# Altium project Badge.PrjPcb
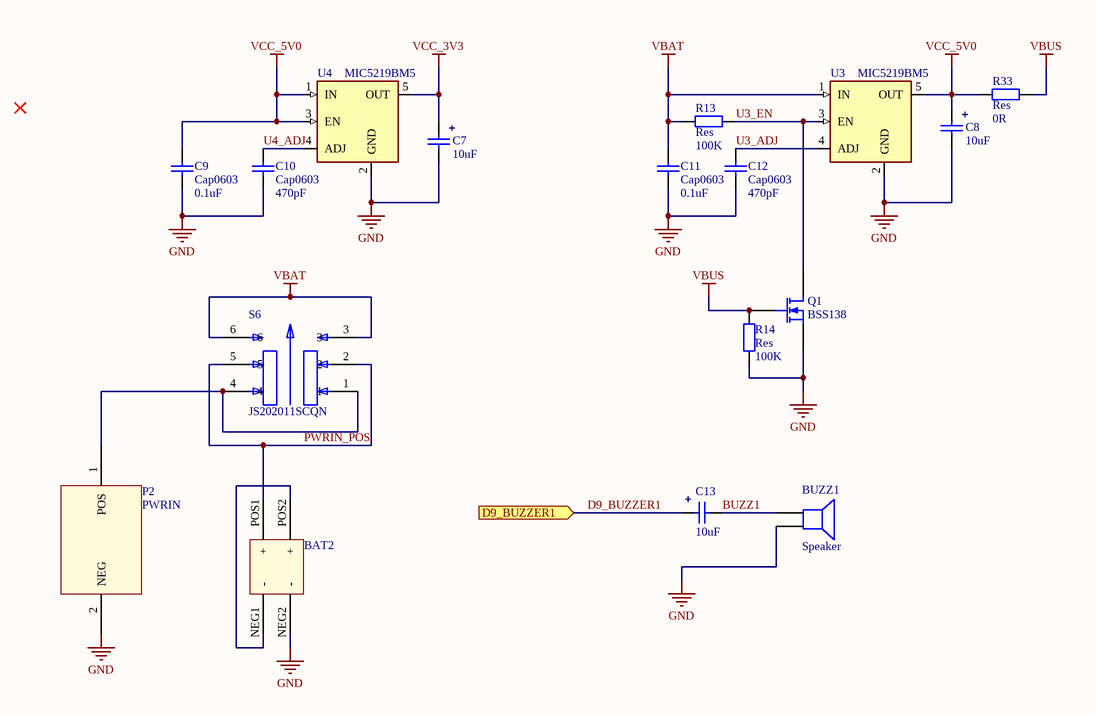
[diagram p0: badge2.SchDoc]
5 sheets, 95 parts. Net scope: flat (ports and power ports of the same name join across sheets).
Board file: badge.PcbDoc
Sheets:
  badge2.SchDoc
  badge3.SchDoc
  badge4.SchDoc
  badge5.SchDoc
  badge.SchDoc

## Sheet badge2.SchDoc
size Letter

### Parts
BAT2  BATT_18650x2  [BATT_18650x2]  (value not drawn)
BUZZ1  Speaker  [SMC]
C7  value 10uF  [C1206 _POL]
C8  value 10uF  [C1206 _POL]
C9  Cap0603  value 0.1uF  [C0603]
C10  Cap0603  value 470pF  [C0603]
C11  Cap0603  value 0.1uF  [C0603]
C12  Cap0603  value 470pF  [C0603]
C13  value 10uF  [C1206 _POL]
P2  PWRIN  [PWRIN]
Q1  BSS138  [SOT23_N]
R13  Res  value 100K  [R0603]
R14  Res  value 100K  [R0603]
R33  Res  value 0R  [R0603]
S6  JS202011SCQN  [SW_JS202011SCQN]
U3  MIC5219BM5  [SOT23-5_N]
U4  MIC5219BM5  [SOT23-5_N]

### Ports
D9_BUZZER1 (in)

### Nets
GND: BAT2.NEG2(-) BUZZ1.2 C7.2 C8.2 C9.1 C10.1 C11.1 C12.1 P2.2(NEG) Q1.2(S) R14.1 U3.2(GND) U4.2(GND)
VBAT: C11.2 R13.1 S6.3 S6.6 U3.1(IN)
VBUS: Q1.3(G) R14.2 R33.2
VCC_3V3: C7.1 U4.5(OUT)
VCC_5V0: C8.1 C9.2 R33.1 U3.5(OUT) U4.1(IN) U4.3(EN)
BUZZ1: BUZZ1.1 C13.2
D9_BUZZER1: C13.1 ; port D9_BUZZER1
PWRIN_POS: BAT2.POS1(+) S6.2 S6.5
U3_ADJ: C12.2 U3.4(ADJ)
U3_EN: Q1.1(D) R13.2 U3.3(EN)
U4_ADJ: C10.2 U4.4(ADJ)
NetBAT2_NEG1: BAT2.NEG1(-) BAT2.POS2(+)
NetP2_1: P2.1(POS) S6.1 S6.4

### Notes on the sheet
- (in symbol CapPol) +

### Library data of the parts
BAT2 = BATT_18650x2: MF: DNP; MP: DNP
BUZZ1 = Speaker: Loudspeaker; MF: DNP; Published: 24-Mar-1999; LatestRevisionDate: 17-Jul-2002; LatestRevisionNote: Re-released for DXP Platform.; PackageReference: PIN2; Publisher: Altium Limited; MP: DNP
C7 C8 C13 = CapPol: Capacitor; MF: KEMET; MP: T491A106K010AT; Published: 8-Jun-2000; LatestRevisionDate: 17-Jul-2002; LatestRevisionNote: Re-released for DXP Platform.; PackageReference: CAP_POL; Publisher: Altium Limited; PackageDescription: SMD Capacitor
C9 = Cap0603: Capacitor; MF: KEMET; MP: C0603C104Z3VACTU; Published: 8-Jun-2000; LatestRevisionDate: 17-Jul-2002; LatestRevisionNote: Re-released for DXP Platform.; PackageReference: 0603; Publisher: Altium Limited; PackageDescription: SMD Capacitor
C10 C12 = Cap0603: Capacitor; MF: KEMET; MP: C0603C471J1GACTU; Published: 8-Jun-2000; LatestRevisionDate: 17-Jul-2002; LatestRevisionNote: Re-released for DXP Platform.; PackageReference: 0603; Publisher: Altium Limited; PackageDescription: SMD Capacitor
C11 = Cap0603: Capacitor; MF: KEMET; MP: C0603C104M4RACTU; Published: 8-Jun-2000; LatestRevisionDate: 17-Jul-2002; LatestRevisionNote: Re-released for DXP Platform.; PackageReference: 0603; Publisher: Altium Limited; PackageDescription: SMD Capacitor
P2 = PWRIN: MF: Molex; MP: S2B-PH-SM4-TB(LF)(SN)
Q1 = MOSFET-N: N-Channel MOSFET; MF: ON Semiconductor; MP: ATSAMD11C14A-SSNTDKR-ND; Published: 8-Jun-2000; LatestRevisionDate: 17-Jul-2002; LatestRevisionNote: Re-released for DXP Platform.; PackageVersion: 1995/1996; PackageReference: E3; Publisher: Altium Limited; PackageDescription: TO, Flat Index; 3 In-Line, Axial Leads; Body Dia. 4.6mm; Lead Dia. 0.5 mm (max)
R13 R14 = Res: Resistor; MF: Yageo; MP: RC0603JR-07100KL; Published: 8-Jun-2000; LatestRevisionDate: 17-Jul-2002; LatestRevisionNote: Re-released for DXP Platform.; PackageReference: AXIAL-0.4; Publisher: Altium Limited; PackageDescription: SMD Resistor
R33 = Res: Resistor; MF: Yageo; MP: RC0603JR-070RL; Published: 8-Jun-2000; LatestRevisionDate: 17-Jul-2002; LatestRevisionNote: Re-released for DXP Platform.; PackageReference: AXIAL-0.4; Publisher: Altium Limited; PackageDescription: SMD Resistor
S6 = JS202011SCQN: Slide Switch DPDT Surface Mount; MF: C&K; MP: JS202011SCQN; Value: *; Package: None; SnapEDA_Link: https://www.snapeda.com/parts/JS202011SCQN/C%26K/view-part/592122/?ref=snap; Digi-Key_Part_Number: 401-2002-1-ND; Digi-Key_Purchase_URL: https://www.digikey.com/product-detail/en/c-k/JS202011SCQN/401-2002-1-ND/1640098?utm_source=snapeda&utm_medium=aggregator&utm_campaign=symbol
U3 U4 = MIC5219BM5: Linear Voltage Regulator IC 1 Output 500mA SOT-23-5; MF: Micrel; Package: SOT-753 Micrel; Value: *; Price: None; MP: MIC5219BM5; Availability: Unavailable; SnapEDA_Link: https://www.snapeda.com/parts/MIC5219BM5/Micrel/view-part/553192/?ref=snap

## Sheet badge3.SchDoc
size Letter
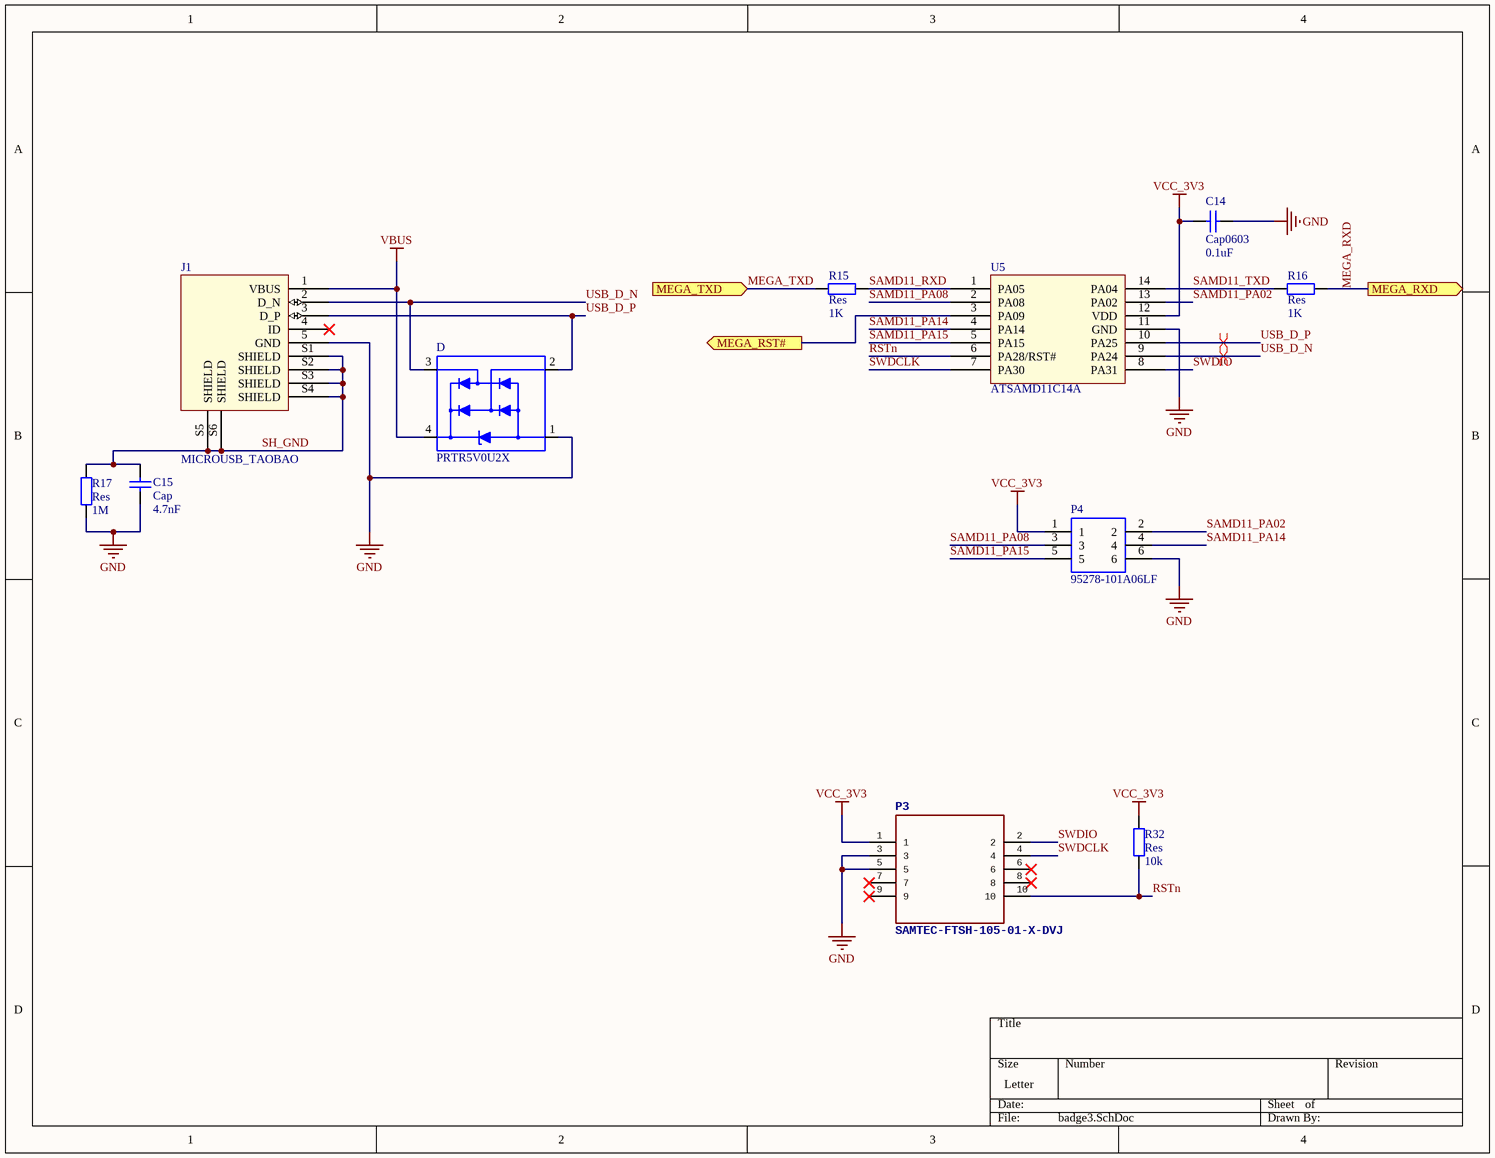
[diagram p1: badge3.SchDoc]

### Parts
C14  Cap0603  value 0.1uF  [C0603]
C15  Cap  value 4.7nF  [C0805]
D  PRTR5V0U2X  [SOT190P230X110-4N]
J1  MICROUSB_TAOBAO  [MICROUSB_TAOBAO]
P3  SAMTEC-FTSH-105-01-X-DVJ  [SAMTEC-FTSH-105-01-X-DV]
P4  95278-101A06LF  [AMPHENOL_95278-101A06LF]
R15  Res  value 1K  [R0603]
R16  Res  value 1K  [R0603]
R17  Res  value 1M  [R0603]
R32  Res  value 10k  [R0603]
U5  ATSAMD11C14A  [SOIC127P600X175-14N]

### Ports
MEGA_RST# (out), MEGA_RXD (out), MEGA_TXD (in)

### Nets
GND: C14.2 C15.1 D.1(GND) J1.5(GND) P3.3 P3.5 P4.6 R17.1 U5.11(GND)
VBUS: D.4(VCC) J1.1(VBUS)
VCC_3V3: C14.1 P3.1 P4.1 R32.2 U5.12(VDD)
MEGA_RST#: U5.3(PA09) ; port MEGA_RST#
MEGA_RXD: R16.2 ; port MEGA_RXD
MEGA_TXD: R15.1 ; port MEGA_TXD
RSTn: P3.10 R32.1 U5.6(PA28/RST#)
SAMD11_PA02: P4.2 U5.13(PA02)
SAMD11_PA08: P4.3 U5.2(PA08)
SAMD11_PA14: P4.4 U5.4(PA14)
SAMD11_PA15: P4.5 U5.5(PA15)
SAMD11_RXD: R15.2 U5.1(PA05)
SAMD11_TXD: R16.1 U5.14(PA04)
SH_GND: C15.2 J1.S1(SHIELD) J1.S2(SHIELD) J1.S3(SHIELD) J1.S4(SHIELD) J1.S5(SHIELD) J1.S6(SHIELD) R17.2
SWDCLK: P3.4 U5.7(PA30)
SWDIO: P3.2 U5.8(PA31)
USB_D_N: D.3(I/O_2) J1.2(D_N) U5.9(PA24)
USB_D_P: D.2(I/O_1) J1.3(D_P) U5.10(PA25)

Not connected (* = marked no-connect by the designer): J1 4(ID)*; P3 6* 7* 8* 9*

### Layout directives
differential pair: USB_D_N, USB_D_P

### Library data of the parts
C14 = Cap0603: as C9 on sheet badge2; Published: 8-Jun-2000; LatestRevisionDate: 17-Jul-2002; LatestRevisionNote: Re-released for DXP Platform.; PackageReference: 0603; Publisher: Altium Limited; PackageDescription: SMD Capacitor
C15 = Cap: Capacitor; MP: C0805C472KDRACTU; MF: KEMET; Published: 8-Jun-2000; LatestRevisionDate: 17-Jul-2002; LatestRevisionNote: Re-released for DXP Platform.; PackageReference: 0805; Publisher: Altium Limited; PackageDescription: SMD Capacitor
D = PRTR5V0U2X: Clamp Ipp Tvs Diode Surface Mount SOT-143B; MF: NXP Semiconductors; Package: SOT-143 NXP Semiconductors; MP: PRTR5V0U2X; Availability: Unavailable; Price: None; Value: *; SnapEDA_Link: https://www.snapeda.com/parts/PRTR5V0U2X/NXP%20Semiconductors/view-part/4254511/?ref=snap
J1 = MICROUSB_TAOBAO: MF: DNP; MP: DNP
P3 = SAMTEC-FTSH-105-01-X-DVJ: MF: Samtec; MP: FTS-105-01-L-DV
P4 = 95278-101A06LF: Connector Header Surface Mount 6 position 0.100 _2.54mm_; MF: Amphenol ICC; Package: None; Value: *; Price: None; MP: 95278-101A06LF; Availability: Unavailable; SnapEDA_Link: https://www.snapeda.com/parts/95278-101A06LF/Amphenol%20FCI/view-part/2763224/?ref=snap
R15 R16 = Res: Resistor; MF: Yageo; MP: RC0603JR-071KL; Published: 8-Jun-2000; LatestRevisionDate: 17-Jul-2002; LatestRevisionNote: Re-released for DXP Platform.; Publisher: Altium Limited; PackageDescription: SMD Resistor
  R15: PackageReference: 0603
  R16: PackageReference: AXIAL-0.4
R17 = Res: Resistor; MF: Yageo; MP: RC0603FR-071ML; Published: 8-Jun-2000; LatestRevisionDate: 17-Jul-2002; LatestRevisionNote: Re-released for DXP Platform.; PackageReference: AXIAL-0.4; Publisher: Altium Limited; PackageDescription: SMD Resistor
R32 = Res: Resistor; MF: Yageo; MP: RC0603JR-0710KL; Published: 8-Jun-2000; LatestRevisionDate: 17-Jul-2002; LatestRevisionNote: Re-released for DXP Platform.; PackageReference: AXIAL-0.4; Publisher: Altium Limited; PackageDescription: SMD Resistor
U5 = ATSAMD11C14A: MF: Atmel; MP: ATSAMD11C14A-SSNTDKR-ND

## Sheet badge4.SchDoc
size Letter
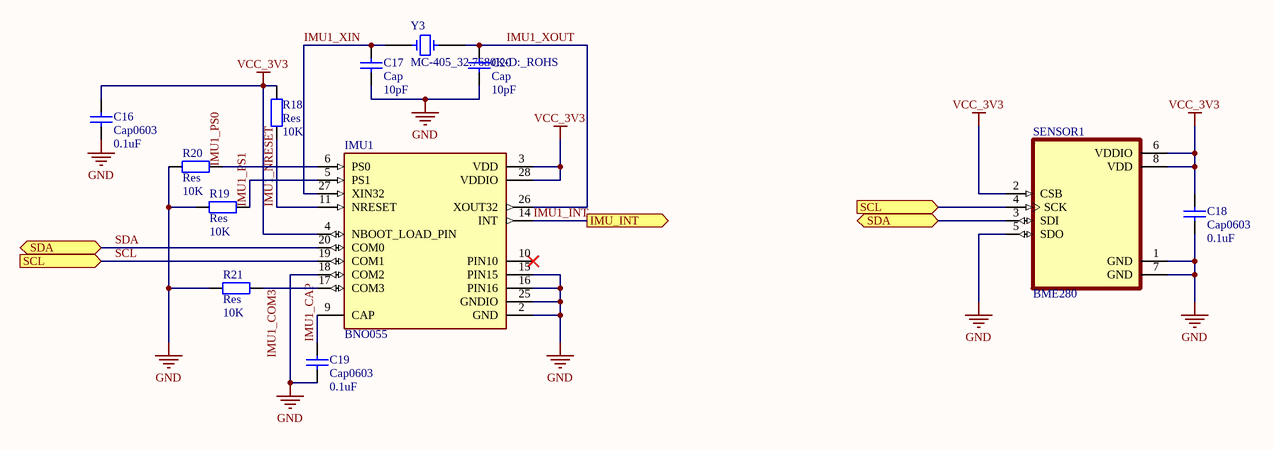
[diagram p2: badge4.SchDoc]

### Parts
C16  Cap0603  value 0.1uF  [C0603]
C17  Cap  value 10pF  [C0603]
C18  Cap0603  value 0.1uF  [C0603]
C19  Cap0603  value 0.1uF  [C0603]
C20  Cap  value 10pF  [C0603]
IMU1  BNO055  [LGA28R50P4X10_380X520X100]
R18  Res  value 10K  [R0603]
R19  Res  value 10K  [R0603]
R20  Res  value 10K  [R0603]
R21  Res  value 10K  [R0603]
SENSOR1  BME280  [PSON65P250X250X100-8N]
Y3  MC-405_32.7680K-D:_ROHS  [XTAL320X150]

### Ports
IMU_INT (out), SCL (in), SDA (bidir)

### Nets
GND: C16.1 C17.1 C18.1 C19.1 C20.1 IMU1.2(GND) IMU1.15(PIN15) IMU1.16(PIN16) IMU1.18(COM2) IMU1.25(GNDIO) R19.1 R20.1 R21.1 SENSOR1.1(GND) SENSOR1.5(SDO) SENSOR1.7(GND)
VCC_3V3: C16.2 C18.2 IMU1.3(VDD) IMU1.4(NBOOT_LOAD_PIN) IMU1.28(VDDIO) R18.2 SENSOR1.2(CSB) SENSOR1.6(VDDIO) SENSOR1.8(VDD)
IMU1_CAP: C19.2 IMU1.9(CAP)
IMU1_COM3: IMU1.17(COM3) R21.2
IMU1_INT: IMU1.14(INT) ; port IMU_INT
IMU1_NRESET: IMU1.11(NRESET) R18.1
IMU1_PS0: IMU1.6(PS0) R20.2
IMU1_PS1: IMU1.5(PS1) R19.2
IMU1_XIN: C17.2 IMU1.27(XIN32) Y3.2
IMU1_XOUT: C20.2 IMU1.26(XOUT32) Y3.1
SCL: IMU1.19(COM1) SENSOR1.4(SCK) ; port SCL
SDA: IMU1.20(COM0) SENSOR1.3(SDI) ; port SDA

Not connected (* = marked no-connect by the designer): IMU1 10(PIN10)*

### Library data of the parts
C16 C18 C19 = Cap0603: as C9 on sheet badge2; Published: 8-Jun-2000; LatestRevisionDate: 17-Jul-2002; LatestRevisionNote: Re-released for DXP Platform.; PackageReference: 0603; Publisher: Altium Limited; PackageDescription: SMD Capacitor
C17 C20 = Cap: Capacitor; MF: KEMET; MP: C0603C100J1GACTU; Published: 8-Jun-2000; LatestRevisionDate: 17-Jul-2002; LatestRevisionNote: Re-released for DXP Platform.; PackageReference: RAD-0.3; Publisher: Altium Limited; PackageDescription: SMD Capacitor
IMU1 = BNO055: Accelerometer, Gyroscope, Magnetometer, 9 Axis Sensor IÂ²C, UART Output; MF: Bosch; Digi-Key_Purchase_URL: https://www.digikey.com/product-detail/en/bosch-sensortec/BNO055/828-1058-1-ND/6136309?utm_source=snapeda&utm_medium=aggregator&utm_campaign=symbol; Value: *; Package: LGA-28 Bosch; MP: BNO055; SnapEDA_Link: https://www.snapeda.com/parts/BNO055/Bosch%20Sensortec/view-part/51961/?ref=snap; Digi-Key_Part_Number: 828-1058-1-ND
R18-R21 = Res: Resistor; MF: Yageo; MP: RC0603JR-0710KL; Published: 8-Jun-2000; LatestRevisionDate: 17-Jul-2002; LatestRevisionNote: Re-released for DXP Platform.; PackageReference: AXIAL-0.4; Publisher: Altium Limited; PackageDescription: SMD Resistor
SENSOR1 = BME280: Humidity Temperature Sensor 0 ~ 100% RH IÂ²C, SPI Â±3% 1s Surface Mount; MF: Bosch; Price: None; Package: LGA-8 Bosch; Value: *; MP: BME280; Availability: Unavailable; SnapEDA_Link: https://www.snapeda.com/parts/BME280/Bosch%20Sensortec/view-part/49769/?ref=snap
Y3 = MC-405_32.7680K-D:_ROHS: 32.768kHz Â±20ppm Crystal 35 kOhms 4-SOJ, 2.29mm pitch; MP: DNP; SnapEDA_Link: https://www.snapeda.com/parts/MC-405%2032.7680K-D:%20ROHS/EPSON/view-part/3612388/?ref=snap; Value: *; Package: 4-4 EPSON; MF: DNP; Price: None; Availability: Unavailable

## Sheet badge5.SchDoc
size Letter
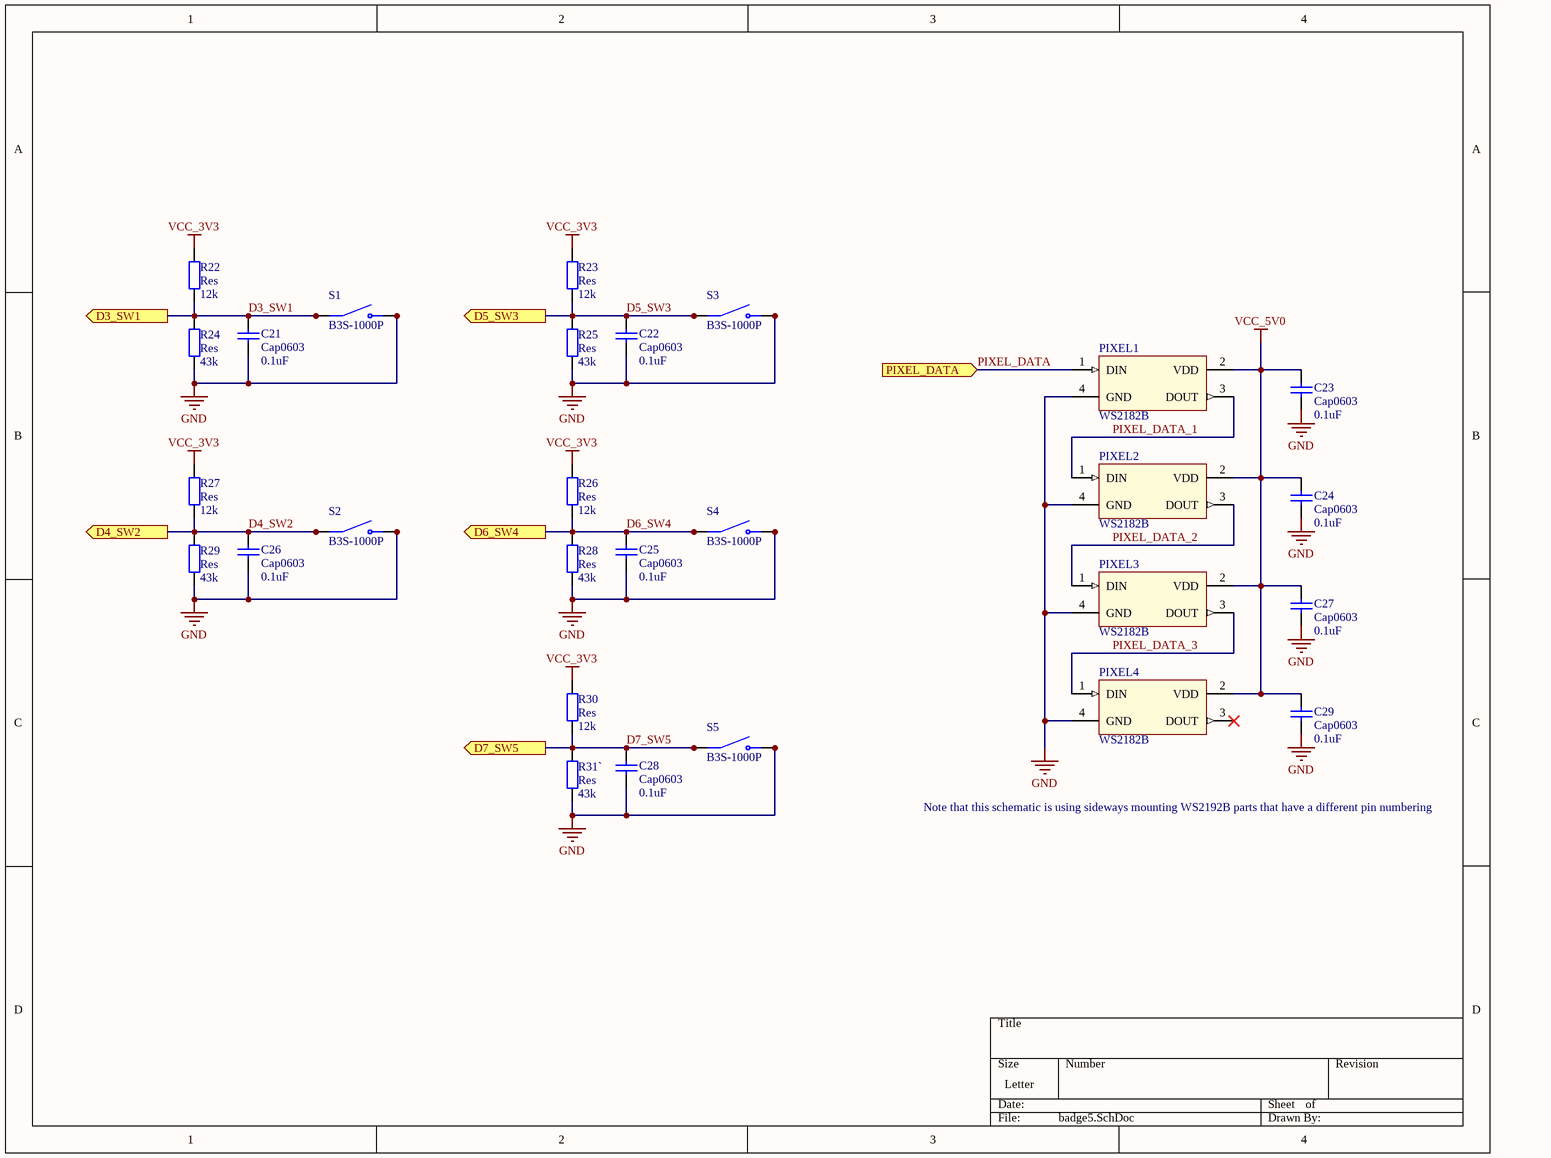
[diagram p3: badge5.SchDoc]

### Parts
C21  Cap0603  value 0.1uF  [C0603]
C22  Cap0603  value 0.1uF  [C0603]
C23  Cap0603  value 0.1uF  [C0603]
C24  Cap0603  value 0.1uF  [C0603]
C25  Cap0603  value 0.1uF  [C0603]
C26  Cap0603  value 0.1uF  [C0603]
C27  Cap0603  value 0.1uF  [C0603]
C28  Cap0603  value 0.1uF  [C0603]
C29  Cap0603  value 0.1uF  [C0603]
PIXEL1  WS2182B  [WS2812B_SIDE]
PIXEL2  WS2182B  [WS2812B_SIDE]
PIXEL3  WS2182B  [WS2812B_SIDE]
PIXEL4  WS2182B  [WS2812B_SIDE]
R22  Res  value 12k  [R0603]
R23  Res  value 12k  [R0603]
R24  Res  value 43k  [R0603]
R25  Res  value 43k  [R0603]
R26  Res  value 12k  [R0603]
R27  Res  value 12k  [R0603]
R28  Res  value 43k  [R0603]
R29  Res  value 43k  [R0603]
R30  Res  value 12k  [R0603]
R31`  Res  value 43k  [R0603]
S1  B3S-1000P  [SW_B3S-1000P]
S2  B3S-1000P  [SW_B3S-1000P]
S3  B3S-1000P  [SW_B3S-1000P]
S4  B3S-1000P  [SW_B3S-1000P]
S5  B3S-1000P  [SW_B3S-1000P]

### Ports
D3_SW1 (out), D4_SW2 (out), D5_SW3 (out), D6_SW4 (out), D7_SW5 (out), PIXEL_DATA (in)

### Nets
GND: C21.1 C22.1 C23.1 C24.1 C25.1 C26.1 C27.1 C28.1 C29.1 PIXEL1.4(GND) PIXEL2.4(GND) PIXEL3.4(GND) PIXEL4.4(GND) R24.1 R25.1 R28.1 R29.1 R31`.1 S1.3(NO) S1.4(NO) S2.3(NO) S2.4(NO) S3.3(NO) S3.4(NO) S4.3(NO) S4.4(NO) S5.3(NO) S5.4(NO)
VCC_3V3: R22.2 R23.2 R26.2 R27.2 R30.2
VCC_5V0: C23.2 C24.2 C27.2 C29.2 PIXEL1.2(VDD) PIXEL2.2(VDD) PIXEL3.2(VDD) PIXEL4.2(VDD)
D3_SW1: C21.2 R22.1 R24.2 S1.1(COM) S1.2(COM) ; port D3_SW1
D4_SW2: C26.2 R27.1 R29.2 S2.1(COM) S2.2(COM) ; port D4_SW2
D5_SW3: C22.2 R23.1 R25.2 S3.1(COM) S3.2(COM) ; port D5_SW3
D6_SW4: C25.2 R26.1 R28.2 S4.1(COM) S4.2(COM) ; port D6_SW4
D7_SW5: C28.2 R30.1 R31`.2 S5.1(COM) S5.2(COM) ; port D7_SW5
PIXEL_DATA: PIXEL1.1(DIN) ; port PIXEL_DATA
PIXEL_DATA_1: PIXEL1.3(DOUT) PIXEL2.1(DIN)
PIXEL_DATA_2: PIXEL2.3(DOUT) PIXEL3.1(DIN)
PIXEL_DATA_3: PIXEL3.3(DOUT) PIXEL4.1(DIN)

Not connected (* = marked no-connect by the designer): PIXEL4 3(DOUT)*

### Notes on the sheet
- Note that this schematic is using sideways mounting WS2192B parts that have a different pin numbering

### Library data of the parts
C21-C29 = Cap0603: as C9 on sheet badge2; Published: 8-Jun-2000; LatestRevisionDate: 17-Jul-2002; LatestRevisionNote: Re-released for DXP Platform.; PackageReference: 0603; Publisher: Altium Limited; PackageDescription: SMD Capacitor
PIXEL1-PIXEL4 = WS2182B: MF: DNP; MP: DNP
R22 R23 R26 R27 R30 = Res: Resistor; MP: RC0603JR-0712KL; MF: Yageo; Published: 8-Jun-2000; LatestRevisionDate: 17-Jul-2002; LatestRevisionNote: Re-released for DXP Platform.; PackageReference: AXIAL-0.4; Publisher: Altium Limited; PackageDescription: SMD Resistor
R24 R25 R28 R29 R31` = Res: Resistor; MF: Yageo; MP: RC0603JR-0743KL; Published: 8-Jun-2000; LatestRevisionDate: 17-Jul-2002; LatestRevisionNote: Re-released for DXP Platform.; PackageReference: 0603; Publisher: Altium Limited; PackageDescription: SMD Resistor
S1-S5 = B3S-1000P: Tactile Switch SPST-NO Top Actuated Surface Mount; MF: Omron Electronics; Package: SMD-4 Omron Electronics Inc-EMC Div; Value: *; Price: None; MP: B3S-1000P; Availability: Unavailable; SnapEDA_Link: https://www.snapeda.com/parts/B3S-1000P/Omron%20Electronics%20Inc-EMC%20Div/view-part/273491/?ref=snap

## Sheet badge.SchDoc
size Letter
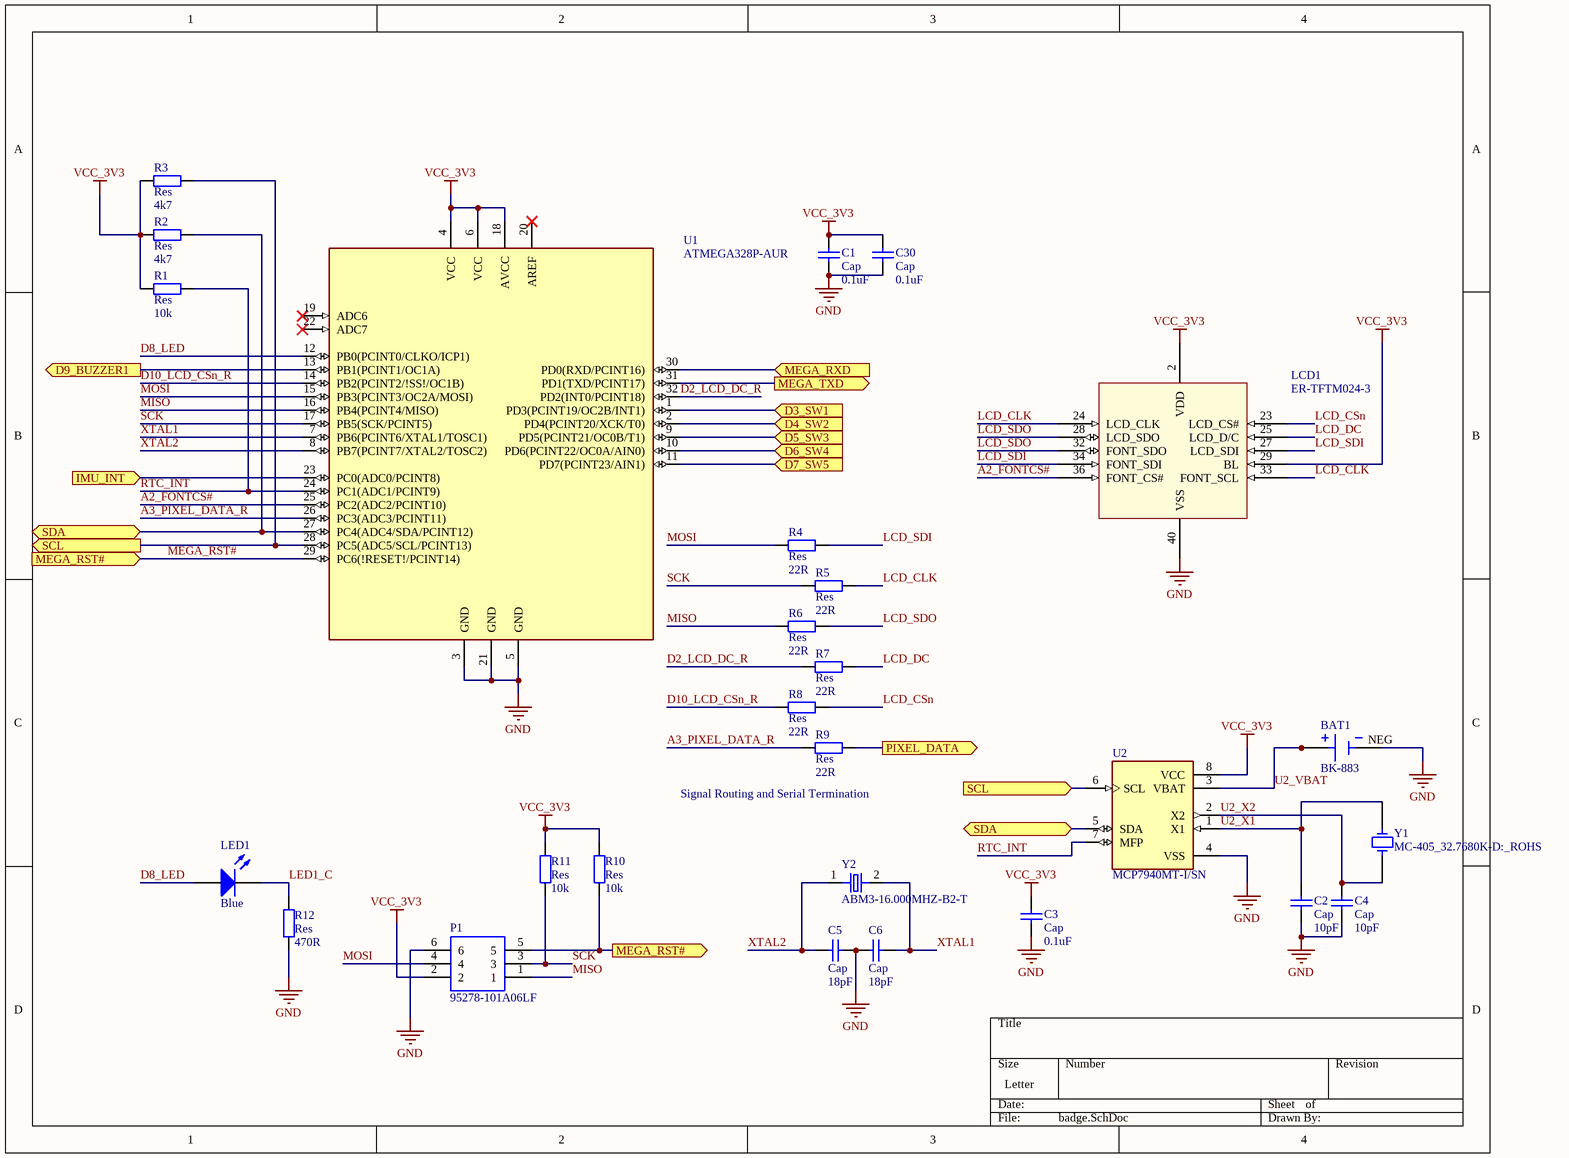
[diagram p4: badge.SchDoc]

### Parts
BAT1  BK-883  [BAT_BK-883]
C1  Cap  value 0.1uF  [C0603]
C2  Cap  value 10pF  [C0603]
C3  Cap  value 0.1uF  [C0603]
C4  Cap  value 10pF  [C0603]
C5  Cap  value 18pF  [C0603]
C6  Cap  value 18pF  [C0603]
C30  Cap  value 0.1uF  [C0603]
LCD1  ER-TFTM024-3  [ER-TFTM024-3]
LED1  Blue  [L0603]
P1  95278-101A06LF  [AMPHENOL_95278-101A06LF]
R1  Res  value 10k  [R0603]
R2  Res  value 4k7  [R0603]
R3  Res  value 4k7  [R0603]
R4  Res  value 22R  [R0603]
R5  Res  value 22R  [R0603]
R6  Res  value 22R  [R0603]
R7  Res  value 22R  [R0603]
R8  Res  value 22R  [R0603]
R9  Res  value 22R  [R0603]
R10  Res  value 10k  [R0603]
R11  Res  value 10k  [R0603]
R12  Res  value 470R  [R0603]
U1  ATMEGA328P-AUR  [QFP80P900X900X120-32N]
U2  MCP7940MT-I/SN  [SOIC127P600X175-8N]
Y1  MC-405_32.7680K-D:_ROHS  [XTAL320X150]
Y2  ABM3-16.000MHZ-B2-T  [XTAL_ECS-100-20-5PVX]

### Ports
D3_SW1 (in), D4_SW2 (in), D5_SW3 (in), D6_SW4 (in), D7_SW5 (in), D9_BUZZER1 (out), IMU_INT (in), MEGA_RST# (in), MEGA_RST# (out), MEGA_RXD (in), MEGA_TXD (out), PIXEL_DATA (out), SCL (in), SCL (out), SDA (bidir)

### Nets
GND: BAT1.NEG C1.1 C2.1 C3.1 C4.1 C5.2 C6.1 C30.1 LCD1.40(VSS) P1.6 R12.1 U1.3(GND) U1.5(GND) U1.21(GND) U2.4(VSS)
VCC_3V3: C1.2 C3.2 C30.2 LCD1.2(VDD) LCD1.29(BL) P1.2 R1.1 R2.1 R3.1 R10.2 R11.2 U1.4(VCC) U1.6(VCC) U1.18(AVCC) U2.8(VCC)
A2_FONTCS#: LCD1.36(FONT_CS#) U1.25(PC2(ADC2/PCINT10))
A3_PIXEL_DATA_R: R9.1 U1.26(PC3(ADC3/PCINT11))
D2_LCD_DC_R: R7.1 U1.32(PD2(INT0/PCINT18))
D3_SW1: U1.1(PD3(PCINT19/OC2B/INT1)) ; port D3_SW1
D4_SW2: U1.2(PD4(PCINT20/XCK/T0)) ; port D4_SW2
D5_SW3: U1.9(PD5(PCINT21/OC0B/T1)) ; port D5_SW3
D6_SW4: U1.10(PD6(PCINT22/OC0A/AIN0)) ; port D6_SW4
D7_SW5: U1.11(PD7(PCINT23/AIN1)) ; port D7_SW5
D8_LED: LED1.1(A) U1.12(PB0(PCINT0/CLKO/ICP1))
D9_BUZZER1: U1.13(PB1(PCINT1/OC1A)) ; port D9_BUZZER1
D10_LCD_CSn_R: R8.1 U1.14(PB2(PCINT2/!SS!/OC1B))
IMU1_INT: U1.23(PC0(ADC0/PCINT8)) ; port IMU_INT
LCD_CLK: LCD1.24(LCD_CLK) LCD1.33(FONT_SCL) R5.2
LCD_CSn: LCD1.23(LCD_CS#) R8.2
LCD_DC: LCD1.25(LCD_D/C) R7.2
LCD_SDI: LCD1.27(LCD_SDI) LCD1.34(FONT_SDI) R4.2
LCD_SDO: LCD1.28(LCD_SDO) LCD1.32(FONT_SDO) R6.2
LED1_C: LED1.2(K) R12.2
MEGA_RST#: P1.5 R10.1 U1.29(PC6(!RESET!/PCINT14)) ; port MEGA_RST#
MEGA_RXD: U1.30(PD0(RXD/PCINT16)) ; port MEGA_RXD
MEGA_TXD: U1.31(PD1(TXD/PCINT17)) ; port MEGA_TXD
MISO: P1.1 R6.1 U1.16(PB4(PCINT4/MISO))
MOSI: P1.4 R4.1 U1.15(PB3(PCINT3/OC2A/MOSI))
PIXEL_DATA: R9.2 ; port PIXEL_DATA
RTC_INT: R1.2 U1.24(PC1(ADC1/PCINT9)) U2.7(MFP)
SCK: P1.3 R5.1 R11.1 U1.17(PB5(SCK/PCINT5))
SCL: R3.2 U1.28(PC5(ADC5/SCL/PCINT13)) U2.6(SCL) ; port SCL
SDA: R2.2 U1.27(PC4(ADC4/SDA/PCINT12)) U2.5(SDA) ; port SDA
U2_VBAT: BAT1.S1+(POS) BAT1.S2+(POS) U2.3(VBAT)
U2_X1: C2.2 U2.1(X1) Y1.2
U2_X2: C4.2 U2.2(X2) Y1.1
XTAL1: C6.2 U1.7(PB6(PCINT6/XTAL1/TOSC1)) Y2.2
XTAL2: C5.1 U1.8(PB7(PCINT7/XTAL2/TOSC2)) Y2.1

Not connected (* = marked no-connect by the designer): U1 19(ADC6)* 20(AREF)* 22(ADC7)*

### Notes on the sheet
- (near R9) Signal Routing and Serial Termination

### Library data of the parts
BAT1 = BK-883: Battery Retainer Coin, 20.0mm 1 Cell SMD _SMT_ Tab; MF: MPD _Memory; MP: BK-883-TR; Value: *; Availability: Unavailable; Package: None; Price: None; SnapEDA_Link: https://www.snapeda.com/parts/BK-883-TR/MPD%20%28Memory%20Protection%20Devices%29/view-part/386772/?ref=snap
C1 = Cap: Capacitor; MP: C0603C104Z3VACTU; MF: KEMET; Published: 8-Jun-2000; LatestRevisionDate: 17-Jul-2002; LatestRevisionNote: Re-released for DXP Platform.; PackageReference: RAD-0.3; Publisher: Altium Limited; PackageDescription: SMD Capacitor
C2 C4 = Cap: as C17 on sheet badge4; Published: 8-Jun-2000; LatestRevisionDate: 17-Jul-2002; LatestRevisionNote: Re-released for DXP Platform.; PackageReference: 0603; Publisher: Altium Limited; PackageDescription: SMD Capacitor
C3 = Cap: Capacitor; MF: KEMET; MP: C0603C104M4RACTU; Published: 8-Jun-2000; LatestRevisionDate: 17-Jul-2002; LatestRevisionNote: Re-released for DXP Platform.; PackageReference: 0603; Publisher: Altium Limited; PackageDescription: SMD Capacitor
C5 C6 = Cap: Capacitor; MF: KEMET; MP: C0603C180J5GACTU; Published: 8-Jun-2000; LatestRevisionDate: 17-Jul-2002; LatestRevisionNote: Re-released for DXP Platform.; PackageReference: 0603; Publisher: Altium Limited; PackageDescription: SMD Capacitor
C30 = Cap: Capacitor; MF: KEMET; MP: C0603C104Z3VACTU; Published: 8-Jun-2000; LatestRevisionDate: 17-Jul-2002; LatestRevisionNote: Re-released for DXP Platform.; PackageReference: RAD-0.3; Publisher: Altium Limited; PackageDescription: SMD Capacitor
LCD1 = ER-TFTM024-3: MF: DNP; MP: DNP
LED1 = LED: Typical INFRARED GaAs LED; MF: OSRAM; MP: LB Q39G-L2OO-35-1; Published: 8-Jun-2000; LatestRevisionDate: 08-Jul-2005; LatestRevisionNote: Mech Layer 1 removed.; PackageReference: LED-0; Publisher: Altium Limited; PackageDescription: LED; 2 Leads
P1 = 95278-101A06LF: as P4 on sheet badge3; Package: None; Value: *; Price: None; MP: 95278-101A06LF; Availability: Unavailable; SnapEDA_Link: https://www.snapeda.com/parts/95278-101A06LF/Amphenol%20FCI/view-part/2763224/?ref=snap
R1 R10 R11 = Res: Resistor; MP: RC0603JR-0710KL; MF: Yageo; Published: 8-Jun-2000; LatestRevisionDate: 17-Jul-2002; LatestRevisionNote: Re-released for DXP Platform.; PackageReference: AXIAL-0.4; Publisher: Altium Limited
  R1: PackageDescription: Axial Device, Thru-Hole; 2 Leads; 0.4 in Pin Spacing
  R10 R11: PackageDescription: SMD Resistor
R2 R3 = Res: Resistor; MF: Yageo; MP: RC0603JR-074K7L; Published: 8-Jun-2000; LatestRevisionDate: 17-Jul-2002; LatestRevisionNote: Re-released for DXP Platform.; PackageReference: AXIAL-0.4; Publisher: Altium Limited; PackageDescription: Axial Device, Thru-Hole; 2 Leads; 0.4 in Pin Spacing
R4-R9 = Res: Resistor; MF: TE Connectivity; MP: CRGCQ0603J22R; Published: 8-Jun-2000; LatestRevisionDate: 17-Jul-2002; LatestRevisionNote: Re-released for DXP Platform.; PackageReference: AXIAL-0.4; Publisher: Altium Limited; PackageDescription: Axial Device, Thru-Hole; 2 Leads; 0.4 in Pin Spacing
R12 = Res: Resistor; MF: TE Connectivity; MP: CRGCQ0603J470R; Published: 8-Jun-2000; LatestRevisionDate: 17-Jul-2002; LatestRevisionNote: Re-released for DXP Platform.; PackageReference: AXIAL-0.4; Publisher: Altium Limited; PackageDescription: SMD Resistor
U1 = ATMEGA328P-AUR: AVR AVRÂ® ATmega Microcontroller IC 8-Bit 20MHz 32KB _16K x 16_ FLASH 32-TQFP _7x7_; MF: Microchip; Package: TQFP-32 Microchip; Digi-Key_Part_Number: ATMEGA328P-AURCT-ND; Digi-Key_Purchase_URL: https://www.digikey.com/product-detail/en/microchip-technology/ATMEGA328P-AUR/ATMEGA328P-AURCT-ND/3789455?utm_source=snapeda&utm_medium=aggregator&utm_campaign=symbol; Value: *; MP: ATMEGA328P-AUR; SnapEDA_Link: https://www.snapeda.com/parts/ATMEGA328P-AUR/Microchip/view-part/1212624/?ref=snap
U2 = MCP7940MT-I/SN: Real Time Clock _RTC_ IC Clock/Calendar 64B IÂ²C, 2-Wire Serial 8-SOIC _0.154, 3.90mm Width_; MF: Microchip; Package: SO-8 Microchip; Value: *; SnapEDA_Link: https://www.snapeda.com/parts/MCP7940MT-I/SN/Microchip/view-part/1118394/?ref=snap; Price: None; MP: MCP7940MT-I/SN; Availability: Unavailable
Y1 = MC-405_32.7680K-D:_ROHS: as Y3 on sheet badge4; SnapEDA_Link: https://www.snapeda.com/parts/MC-405%2032.7680K-D:%20ROHS/EPSON/view-part/3612388/?ref=snap; Value: *; Package: 4-4 EPSON; MF: DNP; Price: None; Availability: Unavailable
Y2 = ABM3-16.000MHZ-B2-T: 16MHz Â±20ppm Crystal 18pF 40 Ohms 2-SMD, No Lead; MP: DNP; Value: *; Package: SMD-2 Abracon; SnapEDA_Link: https://www.snapeda.com/parts/ABM3-16.000MHZ-B2-T/Abracon%20LLC/view-part/55266/?ref=snap; Digi-Key_Part_Number: 535-9103-1-ND; MF: DNP; Digi-Key_Purchase_URL: https://www.digikey.com/product-detail/en/abracon-llc/ABM3-16.000MHZ-B2-T/535-9103-1-ND/675620?utm_source=snapeda&utm_medium=aggregator&utm_campaign=symbol

## Nets that join several sheets
GND: badge2 (13 pins), badge3 (9 pins), badge4 (16 pins), badge5 (28 pins), badge (15 pins)
VBUS: badge2 (Q1.3 R14.2 R33.2), badge3 (D.4 J1.1)
VCC_3V3: badge2 (C7.1 U4.5), badge3 (5 pins), badge4 (9 pins), badge5 (5 pins), badge (15 pins)
VCC_5V0: badge2 (6 pins), badge5 (8 pins)
D3_SW1: badge5 (5 pins), badge (U1.1)
D4_SW2: badge5 (5 pins), badge (U1.2)
D5_SW3: badge5 (5 pins), badge (U1.9)
D6_SW4: badge5 (5 pins), badge (U1.10)
D7_SW5: badge5 (5 pins), badge (U1.11)
D9_BUZZER1: badge2 (C13.1), badge (U1.13)
IMU1_INT: badge4 (IMU1.14), badge (U1.23)
MEGA_RST#: badge3 (U5.3), badge (P1.5 R10.1 U1.29)
MEGA_RXD: badge3 (R16.2), badge (U1.30)
MEGA_TXD: badge3 (R15.1), badge (U1.31)
PIXEL_DATA: badge5 (PIXEL1.1), badge (R9.2)
SCL: badge4 (IMU1.19 SENSOR1.4), badge (R3.2 U1.28 U2.6)
SDA: badge4 (IMU1.20 SENSOR1.3), badge (R2.2 U1.27 U2.5)